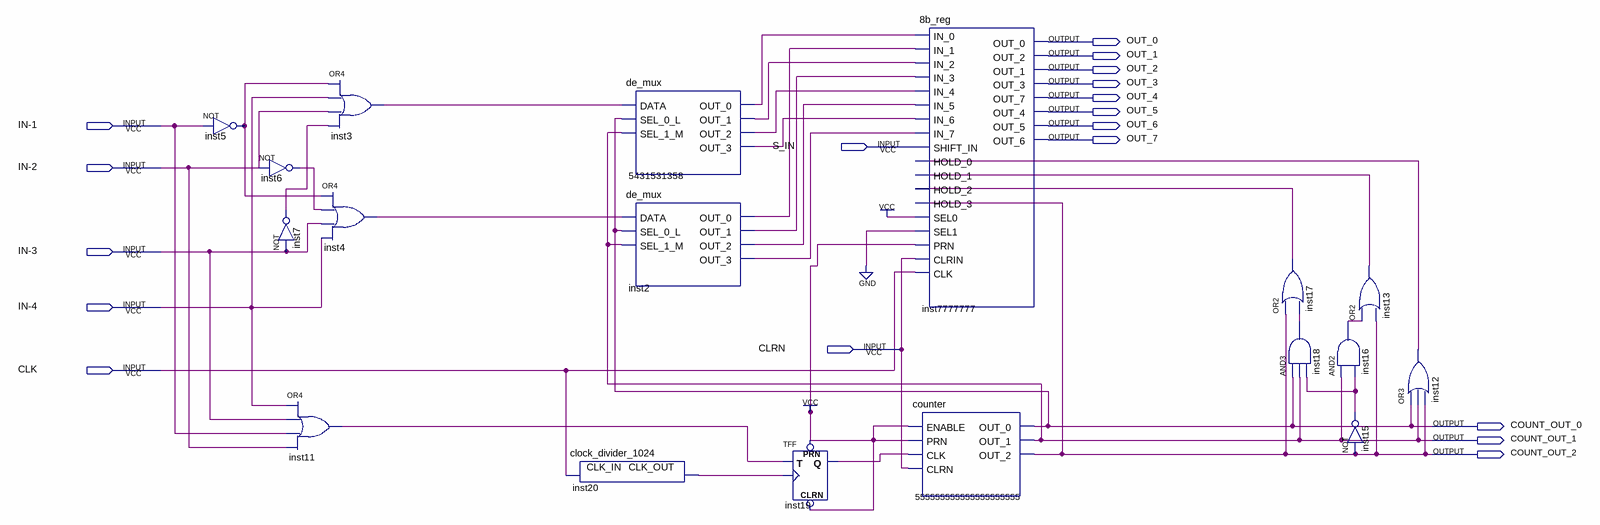
[diagram p0: schematic sheet]
// Quartus schematic EDC.bdf as structural Verilog: 18 symbols, 18 pins
module EDC (
  input  \IN-1 ,
  input  S_IN,
  input  \IN-2 ,
  input  \IN-3 ,
  input  \IN-4 ,
  input  CLRN,
  input  CLK,
  output OUT_0,
  output OUT_1,
  output OUT_2,
  output OUT_3,
  output OUT_4,
  output OUT_5,
  output OUT_6,
  output OUT_7,
  output COUNT_OUT_0,
  output COUNT_OUT_1,
  output COUNT_OUT_2
);

  wire inst2_out_0, inst2_out_1, inst2_out_2, inst2_out_3, inst3_out, inst4_out, inst5_out, inst6_out,
       inst7_out, inst11_out, inst12_out, inst13_out, inst15_out, inst16_out, inst17_out, inst18_out,
       inst19_q, inst20_clk_out, n5431531358_out_0, n5431531358_out_1, n5431531358_out_2, n5431531358_out_3;

  not inst5 (inst5_out, \IN-1 );
  not inst6 (inst6_out, \IN-2 );
  not inst7 (inst7_out, \IN-3 );
  or inst11 (inst11_out, \IN-4 , \IN-3 , \IN-1 , \IN-2 );
  or inst3 (inst3_out, inst5_out, \IN-4 , \IN-2 , inst7_out);
  or inst4 (inst4_out, inst5_out, inst6_out, \IN-3 , \IN-4 );
  clock_divider_1024 inst20 (.CLK_IN(CLK), .CLK_OUT(inst20_clk_out));
  de_mux u_5431531358 (
    .DATA(inst3_out), .SEL_0_L(COUNT_OUT_0), .SEL_1_M(COUNT_OUT_1), .OUT_0(n5431531358_out_0),
    .OUT_1(n5431531358_out_1), .OUT_2(n5431531358_out_2), .OUT_3(n5431531358_out_3));
  de_mux inst2 (
    .DATA(inst4_out), .SEL_0_L(COUNT_OUT_0), .SEL_1_M(COUNT_OUT_1), .OUT_0(inst2_out_0), .OUT_1(inst2_out_1),
    .OUT_2(inst2_out_2), .OUT_3(inst2_out_3));
  TFF inst19 (.PRN(1'b1), .CLRN(1'b1), .T(inst11_out), .CLK(inst20_clk_out), .Q(inst19_q));
  \8b_reg  inst7777777 (
    .HOLD_1(inst13_out), .HOLD_0(inst12_out), .IN_3(inst2_out_1), .IN_2(n5431531358_out_1),
    .IN_1(inst2_out_0), .PRN(1'b1), .SHIFT_IN(S_IN), .IN_0(n5431531358_out_0), .CLK(CLK),
    .IN_4(n5431531358_out_2), .SEL0(1'b1), .SEL1(1'b0), .IN_7(inst2_out_3), .CLRIN(CLRN),
    .IN_6(n5431531358_out_3), .IN_5(inst2_out_2), .HOLD_3(COUNT_OUT_2), .HOLD_2(inst17_out), .OUT_0(OUT_0),
    .OUT_2(OUT_1), .OUT_1(OUT_2), .OUT_3(OUT_3), .OUT_7(OUT_4), .OUT_4(OUT_5), .OUT_5(OUT_6), .OUT_6(OUT_7));
  counter u_555555555555555555555 (
    .ENABLE(1'b1), .PRN(1'b1), .CLK(inst19_q), .CLRN(CLRN), .OUT_0(COUNT_OUT_0), .OUT_1(COUNT_OUT_1),
    .OUT_2(COUNT_OUT_2));
  or inst17 (inst17_out, COUNT_OUT_2, inst18_out);
  and inst18 (inst18_out, COUNT_OUT_0, COUNT_OUT_1, inst15_out);
  or inst13 (inst13_out, inst16_out, COUNT_OUT_2);
  and inst16 (inst16_out, COUNT_OUT_1, inst15_out);
  not inst15 (inst15_out, COUNT_OUT_2);
  or inst12 (inst12_out, COUNT_OUT_0, COUNT_OUT_1, COUNT_OUT_2);
endmodule
